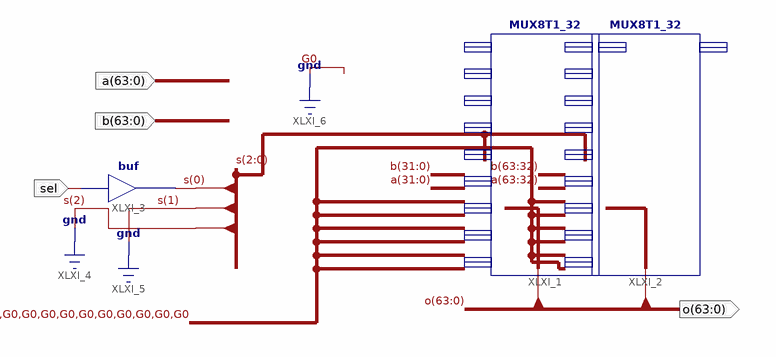
[diagram p0: schematic sheet 1]
// Xilinx ISE schematic MUX2T1_64.sch (kintex7) as structural Verilog: 3 symbols, 4 ports
module MUX2T1_64 (
  input  [63:0] a,
  input  [63:0] b,
  input  sel,
  output [63:0] o
);

  wire [0:0] s;

  MUX8T1_32 XLXI_1 ();  // open: s, I0, I1, I2, I3, I4, I5, I6, I7, o
  MUX8T1_32 XLXI_2 ();  // open: s, I0, I1, I2, I3, I4, I5, I6, I7, o
  buf XLXI_3 (s[0], sel);
endmodule
